# Altium schematic sheet Sensors.SchDoc
size 431 x 279 mm; SheetNumber: 5; SheetTotal: 5; SPICEModelCacheYBELZEHK: <root> / <DocumentId>YBELZEHK</DocumentId> / <CacheFrame Number="0"> / <Model Name="nmos" Kind="MDL"> / <Text>*Default N-Channel MOSFET / *Pinout: D,G,S / .MODEL NMOS NMOS()</Text> / </Model> / </CacheFrame> / </root>
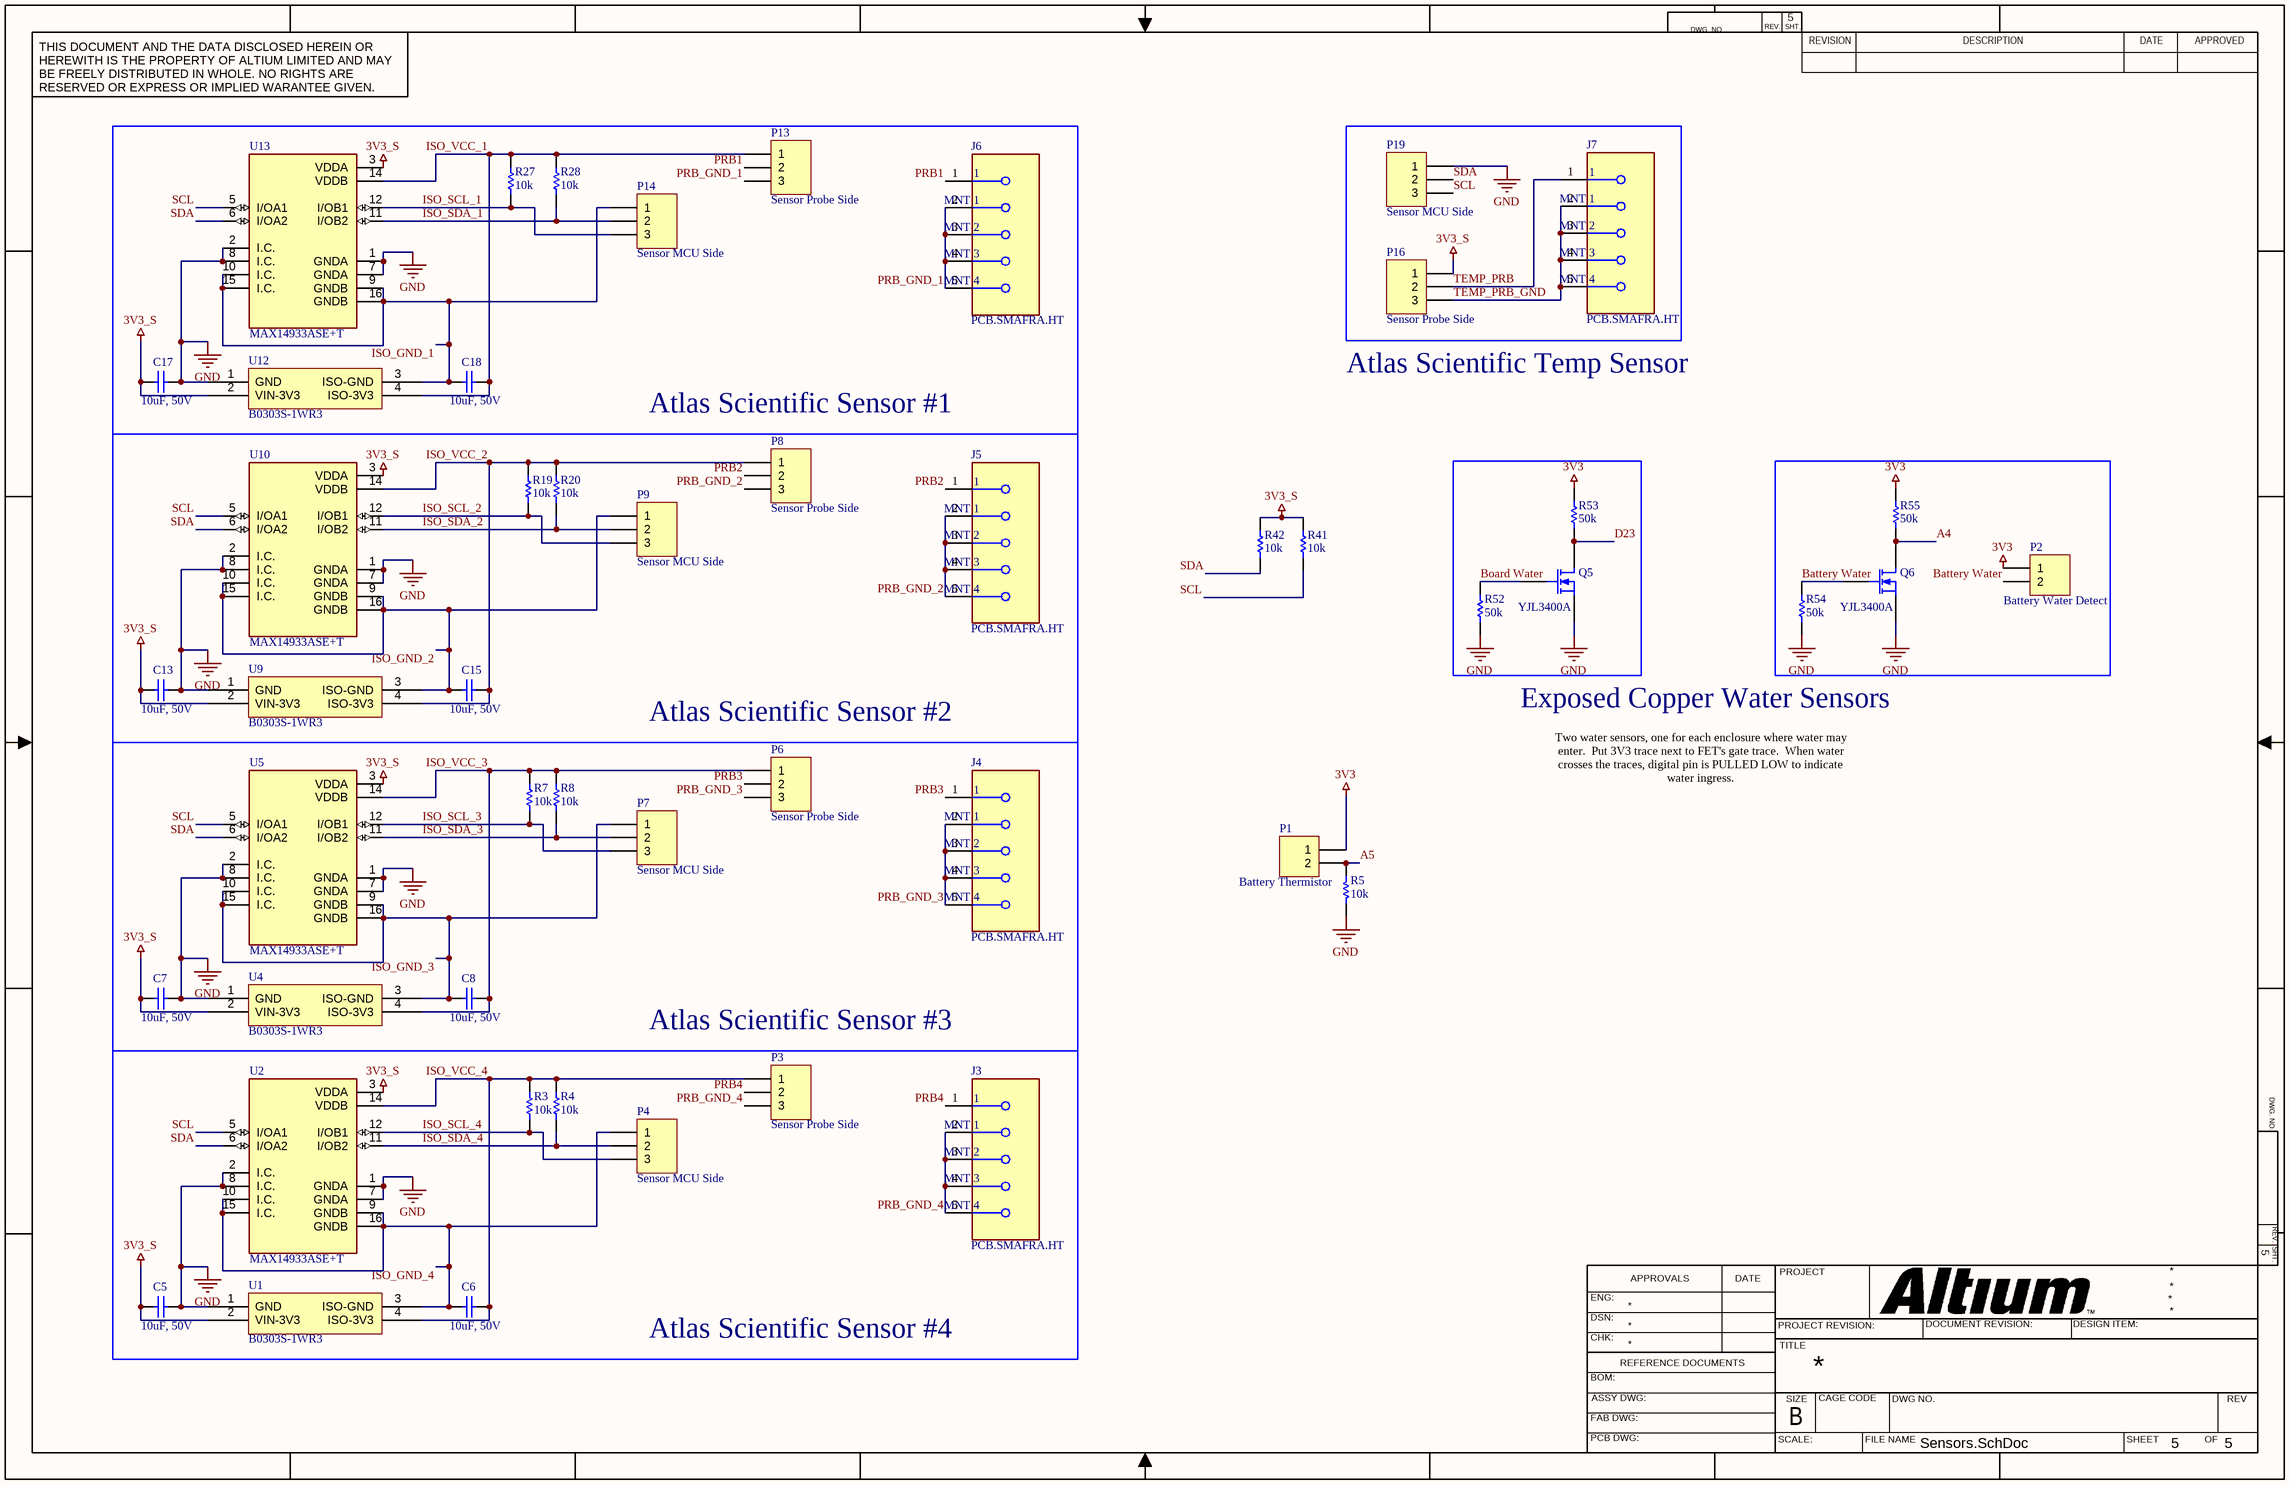
[diagram p0: Sensors.SchDoc]

## Parts
C5  value 10uF, 50V  [CAPC2012X145N]  (hidden comment: Capacitor)
C6  value 10uF, 50V  [CAPC2012X145N]  (hidden comment: Capacitor)
C7  value 10uF, 50V  [CAPC2012X145N]  (hidden comment: Capacitor)
C8  value 10uF, 50V  [CAPC2012X145N]  (hidden comment: Capacitor)
C13  value 10uF, 50V  [CAPC2012X145N]  (hidden comment: Capacitor)
C15  value 10uF, 50V  [CAPC2012X145N]  (hidden comment: Capacitor)
C17  value 10uF, 50V  [CAPC2012X145N]  (hidden comment: Capacitor)
C18  value 10uF, 50V  [CAPC2012X145N]  (hidden comment: Capacitor)
J3  PCB.SMAFRA.HT  [FP-PCB_SMAFRA_HT-MFG]
J4  PCB.SMAFRA.HT  [FP-PCB_SMAFRA_HT-MFG]
J5  PCB.SMAFRA.HT  [FP-PCB_SMAFRA_HT-MFG]
J6  PCB.SMAFRA.HT  [FP-PCB_SMAFRA_HT-MFG]
J7  PCB.SMAFRA.HT  [FP-PCB_SMAFRA_HT-MFG]
P1  Battery Thermistor  [TE_6-440054-2]
P2  Battery Water Detect  [TE_6-440054-2]
P3  Sensor Probe Side  [1x3 Header]
P4  Sensor MCU Side  [1x3 Header]
P6  Sensor Probe Side  [1x3 Header]
P7  Sensor MCU Side  [1x3 Header]
P8  Sensor Probe Side  [1x3 Header]
P9  Sensor MCU Side  [1x3 Header]
P13  Sensor Probe Side  [1x3 Header]
P14  Sensor MCU Side  [1x3 Header]
P16  Sensor Probe Side  [1x3 Header]
P19  Sensor MCU Side  [1x3 Header]
Q5  YJL3400A  [SOT23-3]
Q6  YJL3400A  [SOT23-3]
R3  value 10k  [0603 Resistor]  (hidden comment: Resistor)
R4  value 10k  [0603 Resistor]  (hidden comment: Resistor)
R5  value 10k  [0603 Resistor]  (hidden comment: Resistor)
R7  value 10k  [0603 Resistor]  (hidden comment: Resistor)
R8  value 10k  [0603 Resistor]  (hidden comment: Resistor)
R19  value 10k  [0603 Resistor]  (hidden comment: Resistor)
R20  value 10k  [0603 Resistor]  (hidden comment: Resistor)
R27  value 10k  [0603 Resistor]  (hidden comment: Resistor)
R28  value 10k  [0603 Resistor]  (hidden comment: Resistor)
R41  value 10k  [0603 Resistor]  (hidden comment: Resistor)
R42  value 10k  [0603 Resistor]  (hidden comment: Resistor)
R52  value 50k  [0603 Resistor]  (hidden comment: Resistor)
R53  value 50k  [0603 Resistor]  (hidden comment: Resistor)
R54  value 50k  [0603 Resistor]  (hidden comment: Resistor)
R55  value 50k  [0603 Resistor]  (hidden comment: Resistor)
U1  B0303S-1WR3  [B0303S-1WR3]
U2  MAX14933ASE+T  [SOIC127P600X175-16N]
U4  B0303S-1WR3  [B0303S-1WR3]
U5  MAX14933ASE+T  [SOIC127P600X175-16N]
U9  B0303S-1WR3  [B0303S-1WR3]
U10  MAX14933ASE+T  [SOIC127P600X175-16N]
U12  B0303S-1WR3  [B0303S-1WR3]
U13  MAX14933ASE+T  [SOIC127P600X175-16N]

## Blocks framed on the sheet
Atlas Scientific Sensor #1: C17 C18 J6 P13 P14 R27 R28 U12 U13
Atlas Scientific Sensor #2: C13 C15 J5 P8 P9 R19 R20 U9 U10
Atlas Scientific Sensor #3: C7 C8 J4 P6 P7 R7 R8 U4 U5
Atlas Scientific Sensor #4: C5 C6 J3 P3 P4 R3 R4 U1 U2

## Nets
3V3: P1.1 P2.1 R53.2 R55.2
3V3_S: C5.1 C7.1 C13.1 C17.1 P16.1 R41.2 R42.2 U1.2(VIN-3V3) U2.3(VDDA) U4.2(VIN-3V3) U5.3(VDDA) U9.2(VIN-3V3) U10.3(VDDA) U12.2(VIN-3V3) U13.3(VDDA)
GND: C5.2 C7.2 C13.2 C17.2 P19.1 Q5.2(S) Q6.2(S) R5.1 R52.1 R54.1 U1.1(GND) U2.1(GNDA) U2.2(I.C.) U2.7(GNDA) U2.8(I.C.) U4.1(GND) U5.1(GNDA) U5.2(I.C.) U5.7(GNDA) U5.8(I.C.) U9.1(GND) U10.1(GNDA) U10.2(I.C.) U10.7(GNDA) U10.8(I.C.) U12.1(GND) U13.1(GNDA) U13.2(I.C.) U13.7(GNDA) U13.8(I.C.)
A4: Q6.3(D) R55.1
A5: P1.2 R5.2
Battery Water: P2.2 Q6.1(G) R54.2
Board Water: Q5.1(G) R52.2
D23: Q5.3(D) R53.1
ISO_GND_1: C18.1 P14.1 U12.3(ISO-GND) U13.9(GNDB) U13.10(I.C.) U13.15(I.C.) U13.16(GNDB)
ISO_GND_2: C15.1 P9.1 U9.3(ISO-GND) U10.9(GNDB) U10.10(I.C.) U10.15(I.C.) U10.16(GNDB)
ISO_GND_3: C8.1 P7.1 U4.3(ISO-GND) U5.9(GNDB) U5.10(I.C.) U5.15(I.C.) U5.16(GNDB)
ISO_GND_4: C6.1 P4.1 U1.3(ISO-GND) U2.9(GNDB) U2.10(I.C.) U2.15(I.C.) U2.16(GNDB)
ISO_SCL_1: P14.3 R27.1 U13.12(I/OB1)
ISO_SCL_2: P9.3 R19.1 U10.12(I/OB1)
ISO_SCL_3: P7.3 R7.1 U5.12(I/OB1)
ISO_SCL_4: P4.3 R3.1 U2.12(I/OB1)
ISO_SDA_1: P14.2 R28.1 U13.11(I/OB2)
ISO_SDA_2: P9.2 R20.1 U10.11(I/OB2)
ISO_SDA_3: P7.2 R8.1 U5.11(I/OB2)
ISO_SDA_4: P4.2 R4.1 U2.11(I/OB2)
ISO_VCC_1: C18.2 P13.1 R27.2 R28.2 U12.4(ISO-3V3) U13.14(VDDB)
ISO_VCC_2: C15.2 P8.1 R19.2 R20.2 U9.4(ISO-3V3) U10.14(VDDB)
ISO_VCC_3: C8.2 P6.1 R7.2 R8.2 U4.4(ISO-3V3) U5.14(VDDB)
ISO_VCC_4: C6.2 P3.1 R3.2 R4.2 U1.4(ISO-3V3) U2.14(VDDB)
PRB1: J6.1 P13.2
PRB2: J5.1 P8.2
PRB3: J4.1 P6.2
PRB4: J3.1 P3.2
PRB_GND_1: J6.2(MNT_1) J6.3(MNT_2) J6.4(MNT_3) J6.5(MNT_4) P13.3
PRB_GND_2: J5.2(MNT_1) J5.3(MNT_2) J5.4(MNT_3) J5.5(MNT_4) P8.3
PRB_GND_3: J4.2(MNT_1) J4.3(MNT_2) J4.4(MNT_3) J4.5(MNT_4) P6.3
PRB_GND_4: J3.2(MNT_1) J3.3(MNT_2) J3.4(MNT_3) J3.5(MNT_4) P3.3
SCL: P19.3 R41.1 U2.5(I/OA1) U5.5(I/OA1) U10.5(I/OA1) U13.5(I/OA1)
SDA: P19.2 R42.1 U2.6(I/OA2) U5.6(I/OA2) U10.6(I/OA2) U13.6(I/OA2)
TEMP_PRB: J7.1 P16.2
TEMP_PRB_GND: J7.2(MNT_1) J7.3(MNT_2) J7.4(MNT_3) J7.5(MNT_4) P16.3

## Notes on the sheet
- Atlas Scientific Temp Sensor
- Exposed Copper Water Sensors
- Two water sensors, one for each enclosure where water may enter.  Put 3V3 trace next to FET's gate trace.  When water crosses the traces, digital pin is PULLED LOW to indicate water ingress.
- DWG. NO.
- REV.
- SHT.
- THIS DOCUMENT AND THE DATA DISCLOSED HEREIN OR HEREWITH IS THE PROPERTY OF ALTIUM LIMITED AND MAY BE FREELY DISTRIBUTED IN WHOLE. NO RIGHTS ARE RESERVED OR EXPRESS OR IMPLIED WARANTEE GIVEN.
- REVISION
- DESCRIPTION
- DATE
- APPROVED
- ENG:
- APPROVALS
- PROJECT
- DSN:
- CHK:
- REFERENCE DOCUMENTS
- PROJECT REVISION:
- TITLE
- DOCUMENT REVISION:
- DESIGN ITEM:
- BOM:
- FAB DWG:
- PCB DWG:
- ASSY DWG:
- SCALE:
- SIZE
- B
- CAGE CODE
- FILE NAME
- DWG NO.
- SHEET
- OF
- REV

## Library data of the parts
C5-C8 C13 C15 C17 C18 = Capacitor: SimulationGenericComponent: True
J3-J7 = CMP-111093-000003-1: CONN SMA JACK R/A 50OHM PCB; Dielectric Material: PTFE; Max Frequency: 6GHz; Body Material: Brass; Center Contact Plating: Gold; Voltage Rating: 500V; Operating Frequency: 0 to 6 GHz; Number of Ports: 1; Impedance: 50R; Housing Color: Gold; Mount: Through Hole; Orientation: Right Angle; Termination: Solder; Contact Material: Brass; Series: -; Contact Plating: Gold; Fastening Type: Threaded; Connector Type: SMA; Package Quantity: 500; Case/Package: SMA; Body Plating: Gold; Frequency: 6GHz; Packaging: Tray
P1 P2 = Header 2: Header, 2-Pin; LatestRevisionDate: 17-Jul-2002; LatestRevisionNote: Re-released for DXP Platform.; Publisher: Altium Limited
P3 P4 P6-P9 P13 P14 P16 P19 = Header 3: Header, 3-Pin; LatestRevisionDate: 17-Jul-2002; LatestRevisionNote: Re-released for DXP Platform.; Publisher: Altium Limited
Q5 Q6 = MOSFET-N: N-Channel MOSFET; Published: 8-Jun-2000; LatestRevisionDate: 17-Jul-2002; LatestRevisionNote: Re-released for DXP Platform.; PackageVersion: 1995/1996; PackageReference: E3; Publisher: Altium Limited; PackageDescription: TO, Flat Index; 3 In-Line, Axial Leads; Body Dia. 4.6mm; Lead Dia. 0.5 mm (max)
R3-R5 R7 R8 R19 R20 R27 R28 R41 R42 R52-R55 = Resistor: TC1: 0; SimulationGenericComponent: True; TC2: 0
U1 U4 U9 U12 = B0303S-1WR3: 3V3 Isolator
U2 U5 U10 U13 = MAX14933ASE+T: Package: None; Price: None; Value: *; MP: MAX14933ASE+T; Availability: Unavailable